# Altium schematic sheet 7SEG-3.SchDoc
size A4
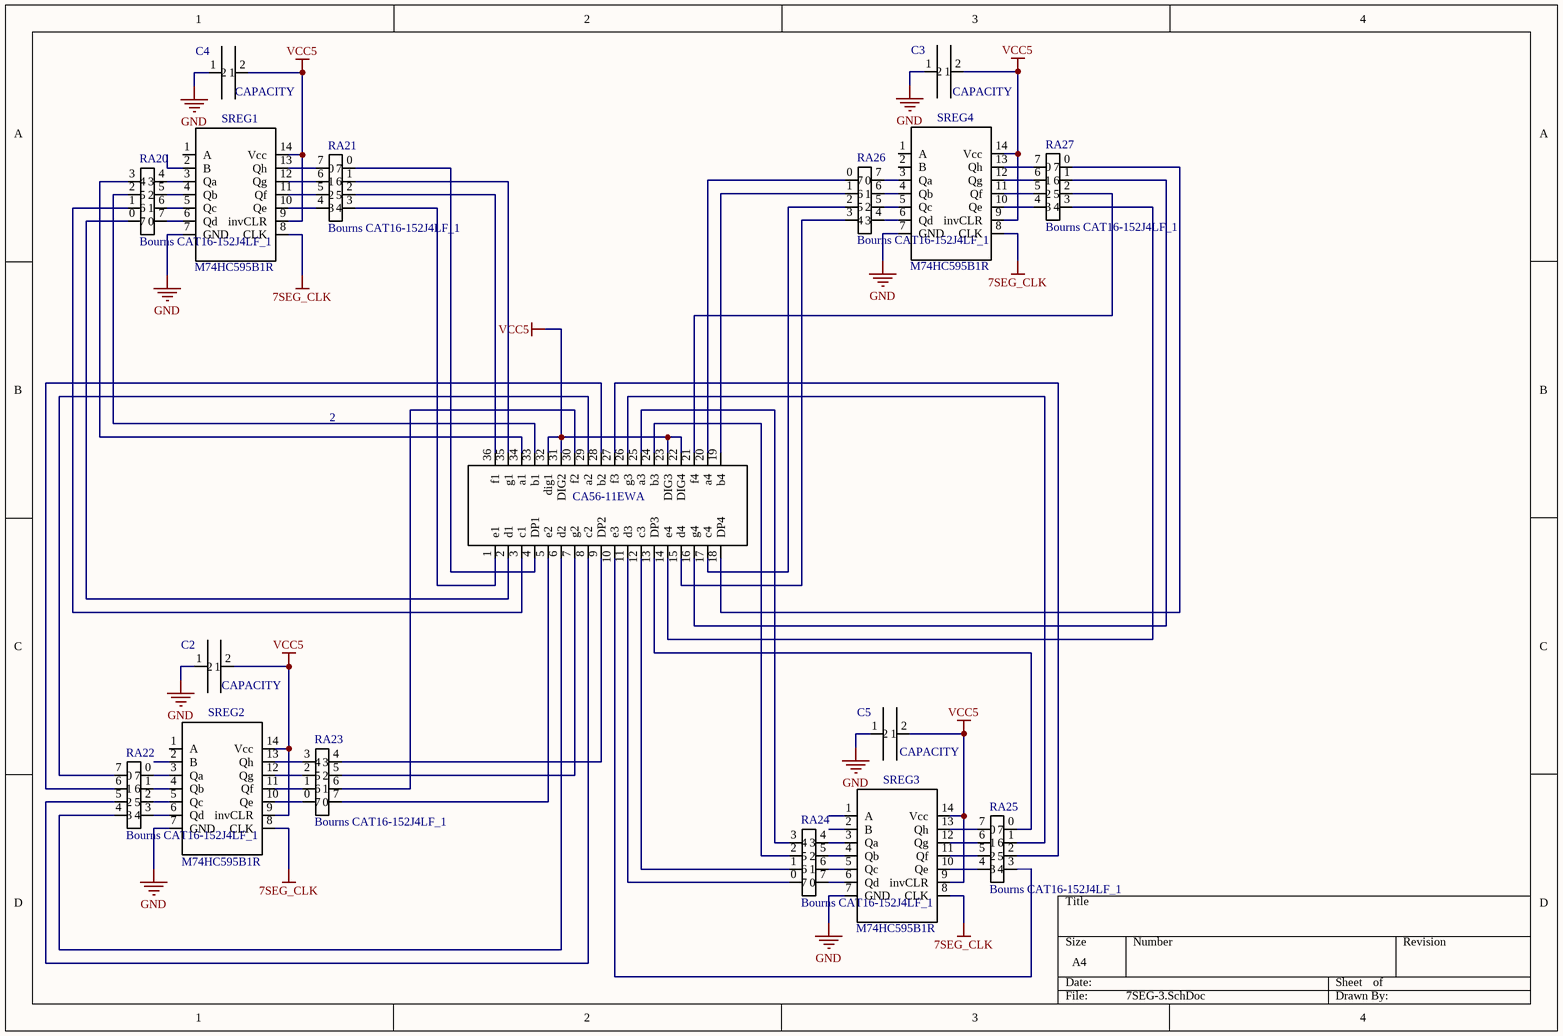
[diagram p0: 7SEG-3.SchDoc]

## Parts
2  CA56-11EWA  [CA56-11EWA]
C2  CAPACITY  [R0805]
C3  CAPACITY  [R0805]
C4  CAPACITY  [R0805]
C5  CAPACITY  [R0805]
RA20  Bourns CAT16-152J4LF_1  [CAT16-102J4LF_2]
RA21  Bourns CAT16-152J4LF_1  [CAT16-102J4LF_2]
RA22  Bourns CAT16-152J4LF_1  [CAT16-102J4LF_2]
RA23  Bourns CAT16-152J4LF_1  [CAT16-102J4LF_2]
RA24  Bourns CAT16-152J4LF_1  [CAT16-102J4LF_2]
RA25  Bourns CAT16-152J4LF_1  [CAT16-102J4LF_2]
RA26  Bourns CAT16-152J4LF_1  [CAT16-102J4LF_2]
RA27  Bourns CAT16-152J4LF_1  [CAT16-102J4LF_2]
SREG1  M74HC595B1R  [SN74HC164DR-D]
SREG2  M74HC595B1R  [SN74HC164DR-D]
SREG3  M74HC595B1R  [SN74HC164DR-D]
SREG4  M74HC595B1R  [SN74HC164DR-D]

## Nets
7SEG_CLK: SREG1.8(CLK) SREG2.8(CLK) SREG3.8(CLK) SREG4.8(CLK)
GND: C2.1 C3.1 C4.1 C5.1 SREG1.7(GND) SREG2.7(GND) SREG3.7(GND) SREG4.7(GND)
VCC5: 2.22(DIG4) 2.23(DIG3) 2.31(DIG2) 2.32(dig1) C2.2 C3.2 C4.2 C5.2 SREG1.9(invCLR) SREG1.14(Vcc) SREG2.9(invCLR) SREG2.14(Vcc) SREG3.9(invCLR) SREG3.14(Vcc) SREG4.9(invCLR) SREG4.14(Vcc)
Net2_1: 2.1(e1) RA21.3
Net2_2: 2.2(d1) RA20.0
Net2_3: 2.3(c1) RA20.1
Net2_4: 2.4(DP1) RA21.0
Net2_5: 2.5(e2) RA23.7
Net2_6: 2.6(d2) RA22.4
Net2_7: 2.7(g2) RA23.5
Net2_8: 2.8(c2) RA22.5
Net2_9: 2.9(DP2) RA23.4
Net2_10: 2.10(e3) RA25.3
Net2_11: 2.11(d3) RA24.0
Net2_12: 2.12(c3) RA24.1
Net2_13: 2.13(DP3) RA25.0
Net2_14: 2.14(e4) RA27.3
Net2_15: 2.15(d4) RA26.3
Net2_16: 2.16(g4) RA27.1
Net2_17: 2.17(c4) RA26.2
Net2_18: 2.18(DP4) RA27.0
Net2_19: 2.19(b4) RA26.1
Net2_20: 2.20(a4) RA26.0
Net2_21: 2.21(f4) RA27.2
Net2_24: 2.24(b3) RA24.2
Net2_25: 2.25(a3) RA24.3
Net2_26: 2.26(g3) RA25.1
Net2_27: 2.27(f3) RA25.2
Net2_28: 2.28(b2) RA22.6
Net2_29: 2.29(a2) RA22.7
Net2_30: 2.30(f2) RA23.6
Net2_33: 2.33(b1) RA20.2
Net2_34: 2.34(a1) RA20.3
Net2_35: 2.35(g1) RA21.1
Net2_36: 2.36(f1) RA21.2
NetRA20_4: RA20.4 SREG1.3(Qa)
NetRA20_5: RA20.5 SREG1.4(Qb)
NetRA20_6: RA20.6 SREG1.5(Qc)
NetRA20_7: RA20.7 SREG1.6(Qd)
NetRA21_4: RA21.4 SREG1.10(Qe)
NetRA21_5: RA21.5 SREG1.11(Qf)
NetRA21_6: RA21.6 SREG1.12(Qg)
NetRA21_7: RA21.7 SREG1.13(Qh)
NetRA22_0: RA22.0 SREG2.3(Qa)
NetRA22_1: RA22.1 SREG2.4(Qb)
NetRA22_2: RA22.2 SREG2.5(Qc)
NetRA22_3: RA22.3 SREG2.6(Qd)
NetRA23_0: RA23.0 SREG2.10(Qe)
NetRA23_1: RA23.1 SREG2.11(Qf)
NetRA23_2: RA23.2 SREG2.12(Qg)
NetRA23_3: RA23.3 SREG2.13(Qh)
NetRA24_4: RA24.4 SREG3.3(Qa)
NetRA24_5: RA24.5 SREG3.4(Qb)
NetRA24_6: RA24.6 SREG3.5(Qc)
NetRA24_7: RA24.7 SREG3.6(Qd)
NetRA25_4: RA25.4 SREG3.10(Qe)
NetRA25_5: RA25.5 SREG3.11(Qf)
NetRA25_6: RA25.6 SREG3.12(Qg)
NetRA25_7: RA25.7 SREG3.13(Qh)
NetRA26_4: RA26.4 SREG4.6(Qd)
NetRA26_5: RA26.5 SREG4.5(Qc)
NetRA26_6: RA26.6 SREG4.4(Qb)
NetRA26_7: RA26.7 SREG4.3(Qa)
NetRA27_4: RA27.4 SREG4.10(Qe)
NetRA27_5: RA27.5 SREG4.11(Qf)
NetRA27_6: RA27.6 SREG4.12(Qg)
NetRA27_7: RA27.7 SREG4.13(Qh)

Not connected (* = marked no-connect by the designer): SREG1 1(A) 2(B); SREG2 1(A) 2(B); SREG3 1(A) 2(B); SREG4 1(A) 2(B)

## Library data of the parts
RA20-RA27 = Bourns CAT16-102J4LF_1